# EAGLE schematic Sudden_XCVF_Transmit_Pre-Driver_Stage (EAGLE 9.2.2)
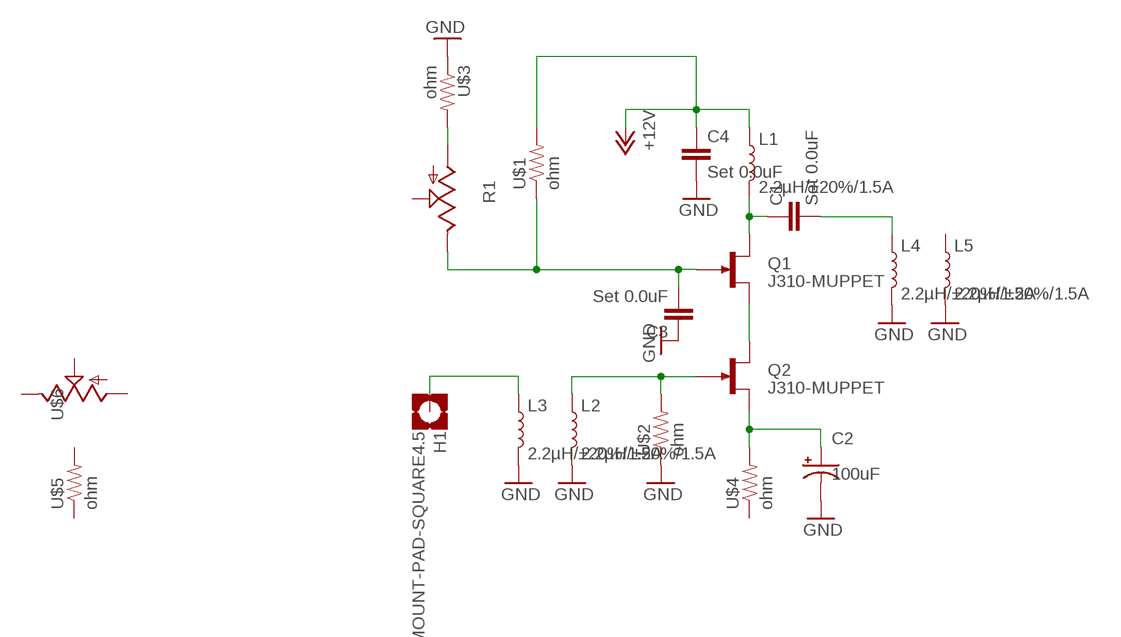
[diagram p0: schematic, sheet 1]

## Parts
C1  Set 0.0uF  CAP-MEDIUM-MUPPET  [CAP-MEDIUM-MUPPET]
C2  100uF  CAP-POLARIZED-RADIAL-2.5MM-25V-20%  [CAP-POLARIZED]
C3  Set 0.0uF  CAP-MEDIUM-MUPPET  [CAP-MEDIUM-MUPPET]
C4  Set 0.0uF  CAP-MEDIUM-MUPPET  [CAP-MEDIUM-MUPPET]
H1  MOUNT-PAD-SQUARE4.5  [PAD-SQUARE]
L1  2.2µH/±20%/1.5A  INDUCTOR-VLF4012AT-2.2UH  [INDUCTOR_2.2UH]
L2  2.2µH/±20%/1.5A  INDUCTOR-VLF4012AT-2.2UH  [INDUCTOR_2.2UH]
L3  2.2µH/±20%/1.5A  INDUCTOR-VLF4012AT-2.2UH  [INDUCTOR_2.2UH]
L4  2.2µH/±20%/1.5A  INDUCTOR-VLF4012AT-2.2UH  [INDUCTOR_2.2UH]
L5  2.2µH/±20%/1.5A  INDUCTOR-VLF4012AT-2.2UH  [INDUCTOR_2.2UH]
P+1  +12V  [POWER-IN-PAD]
Q1  J310-MUPPET  [TO92R-MUPPET]
Q2  J310-MUPPET  [TO92R-MUPPET]
R1  POTENTIOMETER-TRIMCT6  [POT-TRIMM-4]
U$1  ohm  RESISTOR-MUPPETMEDIUM-RESISTOR-PADS  [RESITOR-MUPPET]
U$2  ohm  RESISTOR-MUPPETMEDIUM-RESISTOR-PADS  [RESITOR-MUPPET]
U$3  ohm  RESISTOR-MUPPETMEDIUM-RESISTOR-PADS  [RESITOR-MUPPET]
U$4  ohm  RESISTOR-MUPPETMEDIUM-RESISTOR-PADS  [RESITOR-MUPPET]
U$5  ohm  RESISTOR-MUPPETMEDIUM-RESISTOR-PADS  [RESITOR-MUPPET]
U$6  ohm  POTENTIOMETER-TRIMCT6  [POT-TRIMM-4]

## Nets
+12V: C4.1 L1.P$1 P+1.VCC(+12V) U$1.P$2
GND: C2.2(-) C3.1 C4.2 L2.P$2 L3.P$2 L4.P$2 L5.P$2 U$2.P$1 U$3.P$1
N$1: Q1.S Q2.D
N$2: C1.1 L1.P$2 Q1.D
N$3: C1.2 L4.P$1
N$4: C2.1(+) Q2.S U$4.P$2
N$5: L2.P$1 Q2.G U$2.P$2
N$6: H1.PAD(MOUNT) L3.P$1
N$7: C3.2 Q1.G R1.E U$1.P$1
N$8: R1.A U$3.P$2
Unconnected: L5.P$1 R1.S U$4.P$1 U$5.P$1 U$5.P$2 U$6.A U$6.E U$6.S

## Library data of the parts
C1 C3 C4 = jim_muppet_parts:CAP-MEDIUM-MUPPET: Capacitor - Muppet style - Medium size SMT Pads 120 square SMT pads; PROD_ID: JIM-CAP Large SMT
C2 = jim_muppet_parts:CAP-POLARIZED: 100µF polarized capacitors A capacitor is a passive two-terminal electrical component used to store electrical energy temporarily in an electric field.; PROD_ID: CAP-08439
H1 = jim_muppet_parts:MOUNT-PAD-SQUARE: MOUNTING PAD, square
L1-L5 = jim_muppet_parts:INDUCTOR: Inductors Resist changes in electrical current. Basically a coil of wire. SparkFun Products: SparkFun Load Cell Amplifier - HX711 <https://www.sparkfun.com/products/13879> IOIO-OTG - V2.2 <https://www.sparkfun.com/products/13613>; PROD_ID: NDUC-09513
P+1 = jim_muppet_parts:+12V: SUPPLY SYMBOL
Q1 Q2 = jim_muppet_parts:J310-MUPPET: N-Channel RF Amplifier J309, J310 Source: http://www.fairchildsemi.com/pf/J3/J310.html
R1 U$6 = jim_muppet_parts:POTENTIOMETER-TRIM: POTENTIOMETER
U$1-U$5 = jim_muppet_parts:RESISTOR-MUPPET: Muppet stype resitor 120 square pad; PROD_ID: MUP-RES